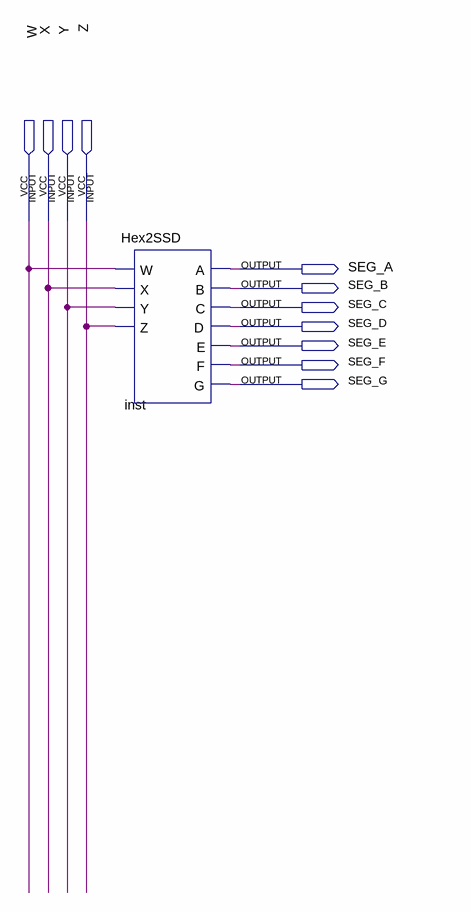
[diagram p0: schematic sheet]
// Quartus schematic BCD2SSD.bdf as structural Verilog: 1 symbols, 11 pins
module BCD2SSD (
  input  W,
  input  X,
  input  Y,
  input  Z,
  output SEG_A,
  output SEG_B,
  output SEG_C,
  output SEG_D,
  output SEG_E,
  output SEG_F,
  output SEG_G
);

  Hex2SSD inst (
    .W(W), .X(X), .Y(Y), .Z(Z), .A(SEG_A), .B(SEG_B), .C(SEG_C), .D(SEG_D), .E(SEG_E), .F(SEG_F), .G(SEG_G));
endmodule
